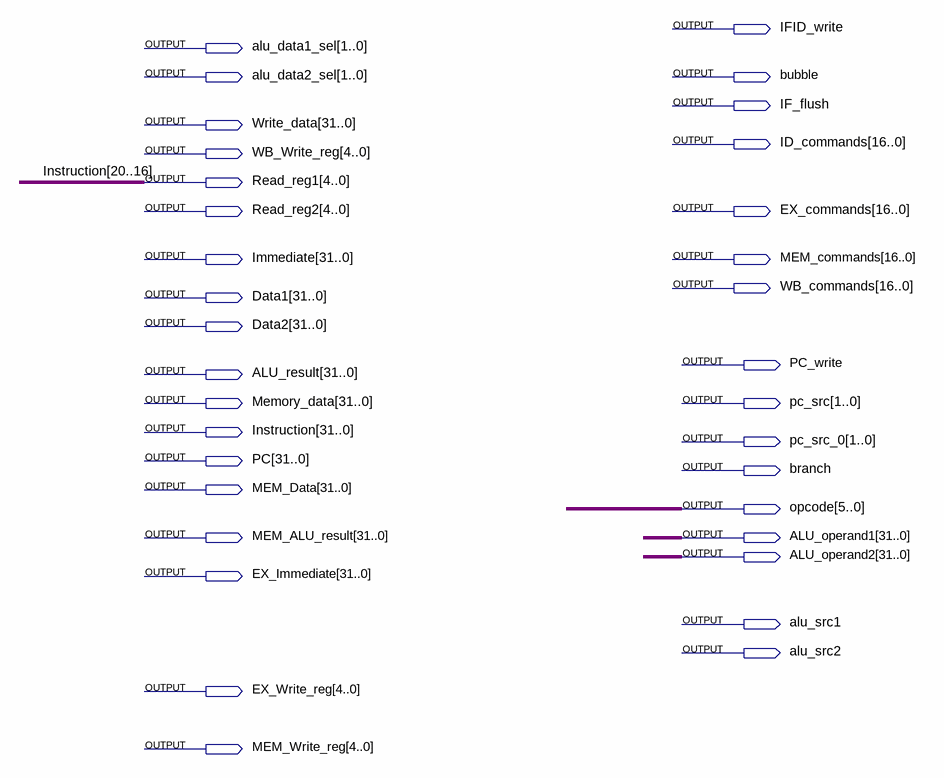
[diagram p0: schematic sheet]
// Quartus schematic outputPorts.bdf as structural Verilog: 0 symbols, 34 pins
module outputPorts (
  output IFID_write,
  output [1:0] alu_data1_sel,
  output [1:0] alu_data2_sel,
  output bubble,
  output IF_flush,
  output [31:0] Write_data,
  output [16:0] ID_commands,
  output [4:0] WB_Write_reg,
  output [4:0] Read_reg1,
  output [4:0] Read_reg2,
  output [16:0] EX_commands,
  output [31:0] Immediate,
  output [16:0] MEM_commands,
  output [16:0] WB_commands,
  output [31:0] Data1,
  output [31:0] Data2,
  output PC_write,
  output [31:0] ALU_result,
  output [31:0] Memory_data,
  output [1:0] pc_src,
  output [31:0] Instruction,
  output [1:0] pc_src_0,
  output [31:0] PC,
  output branch,
  output [31:0] MEM_Data,
  output [5:0] opcode,
  output [31:0] MEM_ALU_result,
  output [31:0] ALU_operand1,
  output [31:0] ALU_operand2,
  output [31:0] EX_Immediate,
  output alu_src1,
  output alu_src2,
  output [4:0] EX_Write_reg,
  output [4:0] MEM_Write_reg
);


  assign Read_reg1 = Instruction[20:16];
endmodule
